# EAGLE board v1.9 (EAGLE 9.6.2)
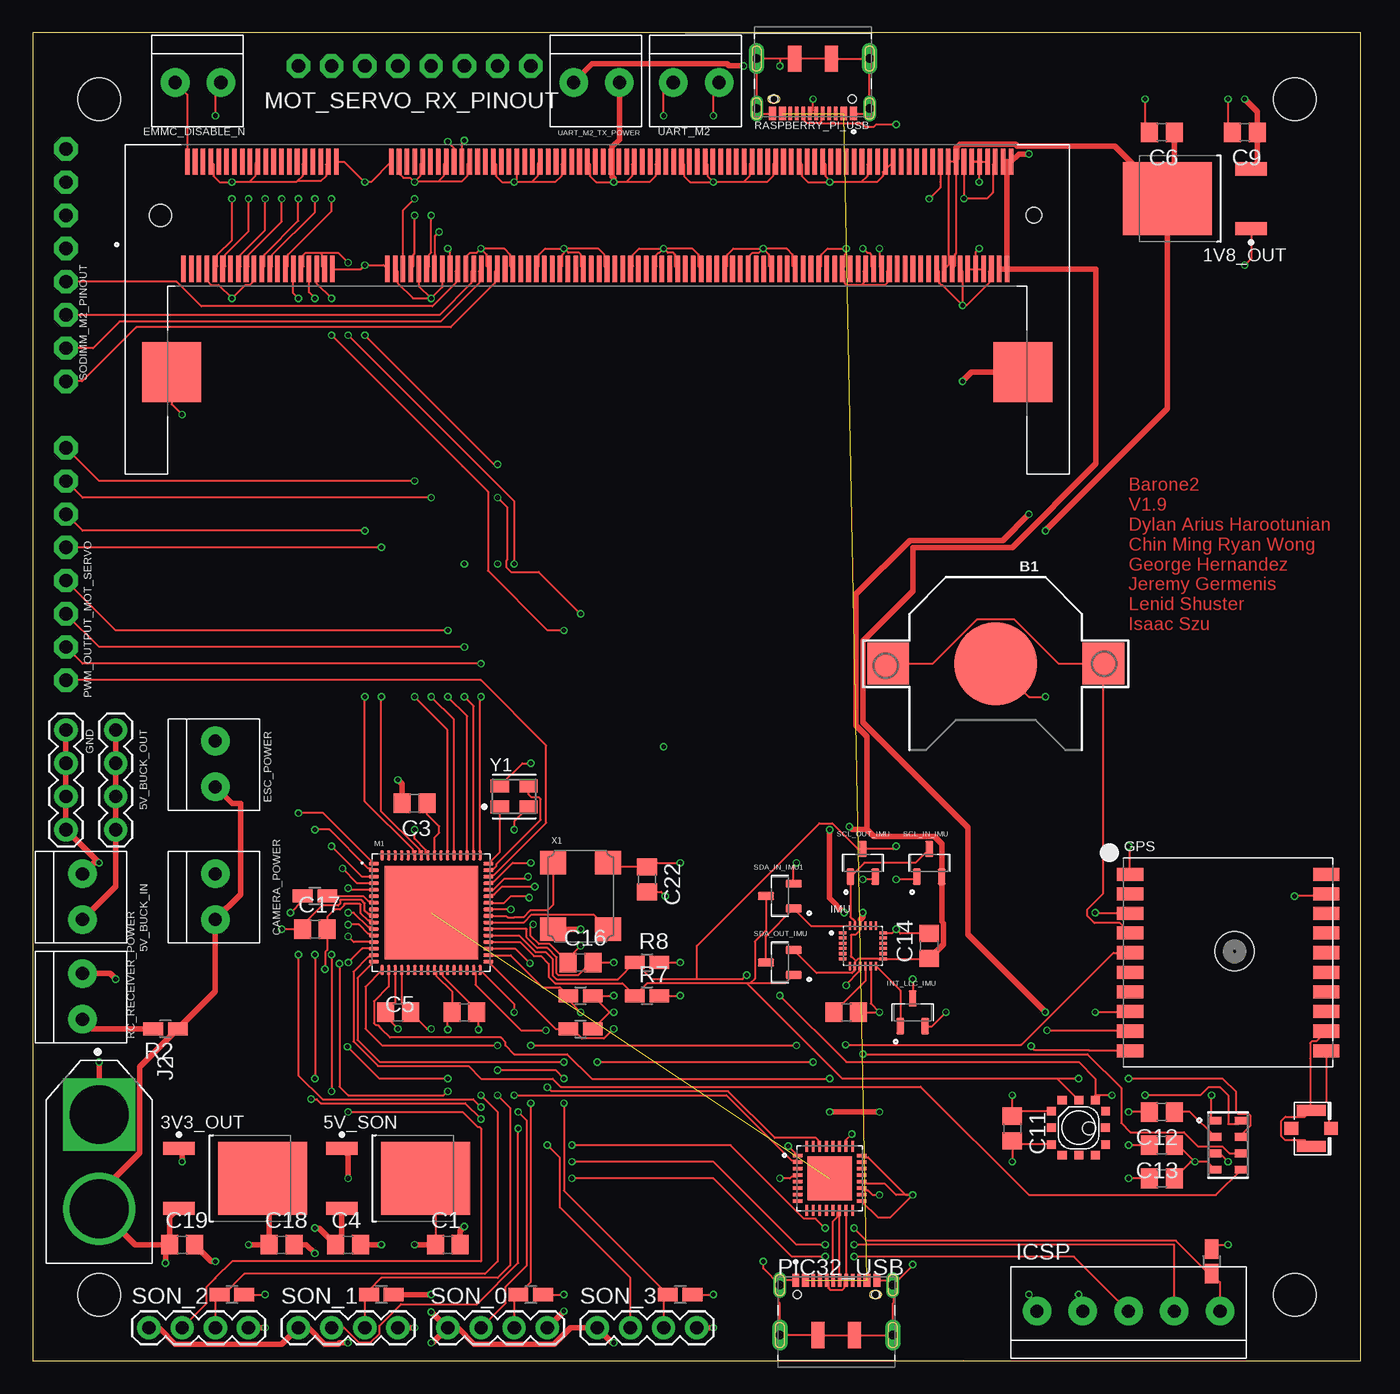
[diagram p2: board, top side]
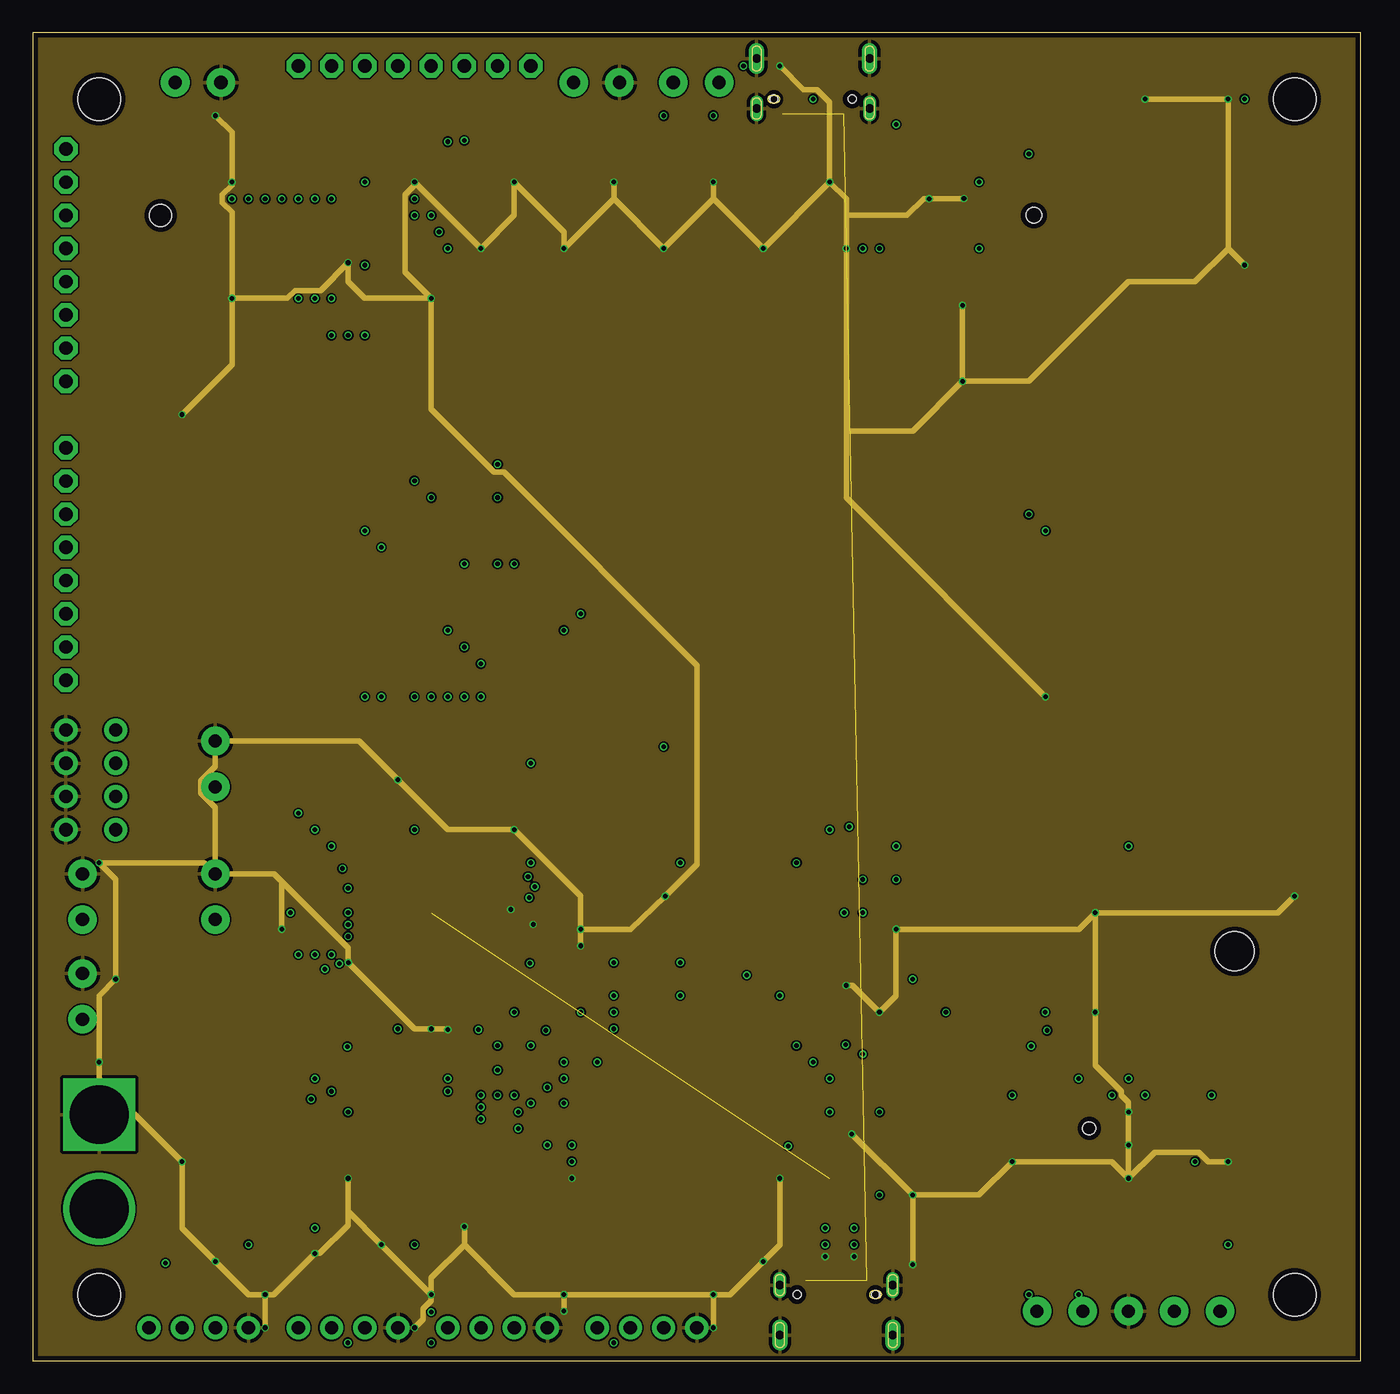
[diagram p3: board, inner layer Route2]
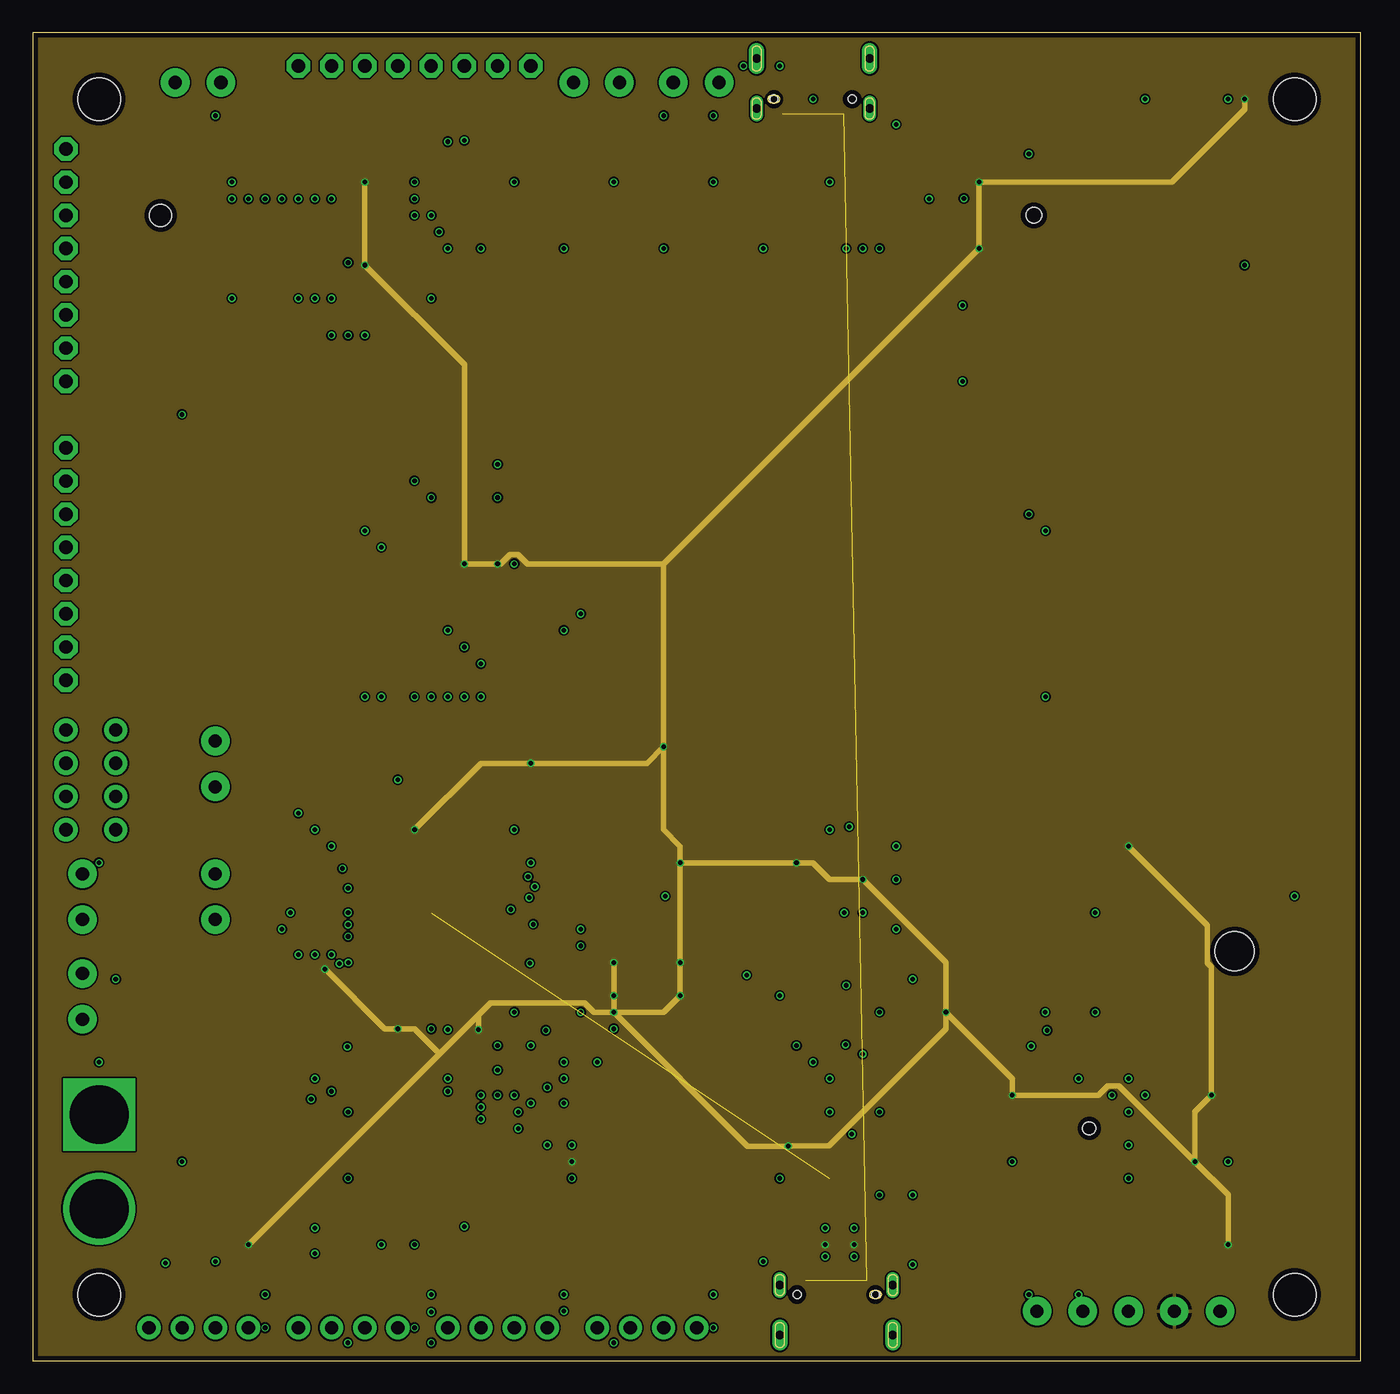
[diagram p4: board, inner layer Route15]
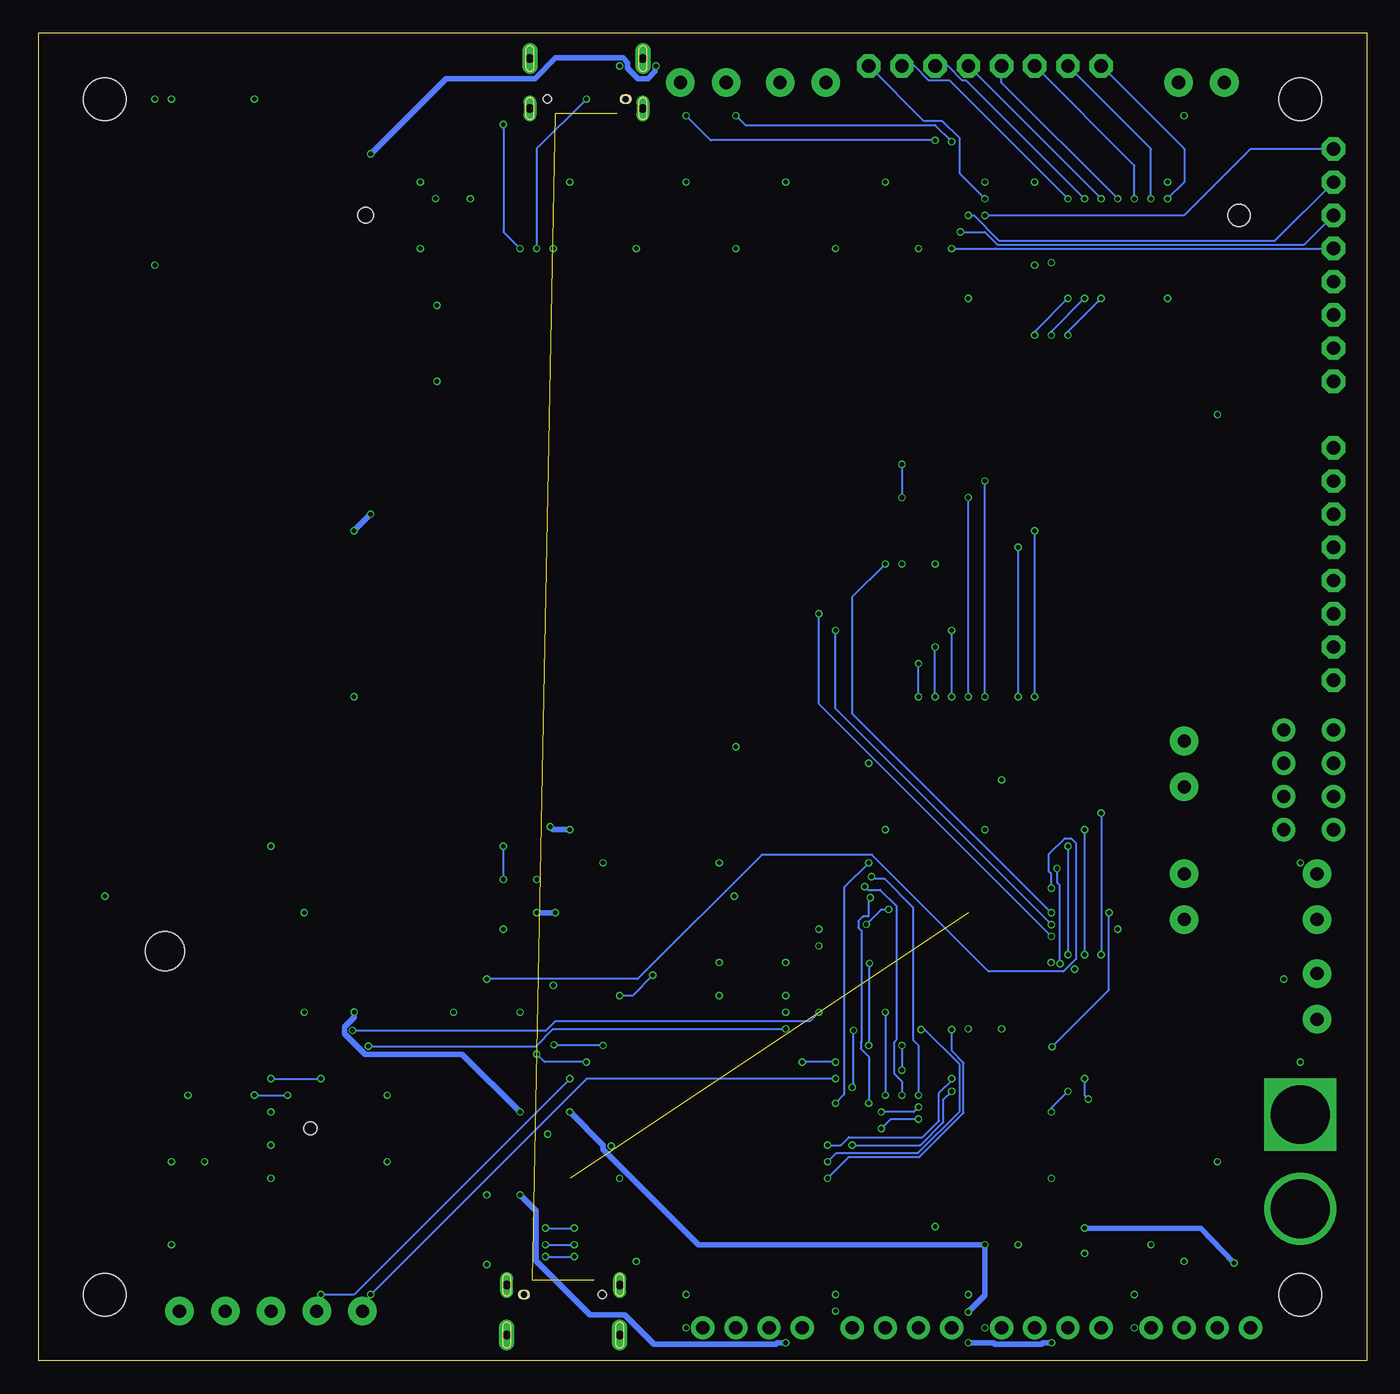
[diagram p5: board, bottom side, seen from below]

Size 101.6 x 101.6 mm. Coordinates in mm from the lower left corner, seen from the top.
Outline: 0,0 101.6,0 101.6,101.6 0,101.6 0,0
Copper layers (1*2*15*16): Top 0.035559375mm / dielectric 0.17018125mm / Route2 0.01778125mm / dielectric 47mil / Route15 0.01778125mm / dielectric 0.17018125mm / Bottom 0.035559375mm
Design rules "oshpark-4layer": minimum track width 5mil, minimum drill 10mil, track to track 5mil, track to pad 5mil, pad to pad 5mil, via to via 5mil, smd to smd 5mil, copper to edge 15mil, drill to drill 6mil, minimum pad ring 4mil, minimum via ring 4mil, stop-mask expansion 1.5mil, vias tented up to drill 0mil, thermal gap 10mil
Holes 3.26 mm at 96.52,5.08 96.52,96.52 5.08,96.52 5.08,5.08

## Footprints (pad centres in the part's own frame; a part is rotated, then mirrored left to right if it is on the bottom)
STMICROELECTRONICS_LD1117DT33CTR_2 = smd 2.4 x 1: 1 -4.3,2.28; 3 -4.3,-2.28 | smd 6.8 x 5.55: 4 2.1,0
1X2-3.5MM = drill 1 pad 2.184: 1 1.8,0; 2 -1.7,0
1X04-BIG = drill 1.016 pad 1.778: 1 0,0; 2 2.54,0; 3 5.08,0; 4 7.62,0
CR1220 = smd 3.2 x 3.2: +$1 -8.225,0; +$2 8.225,0 | smd 6.35 x 6.35: - 0,0
C0805 = smd 1.3 x 1.5: 1 -0.95,0; 2 0.95,0
FGPMMOPA6H = smd 2 x 1: P$1 -7.5,6.75; P$2 -7.5,5.25; P$3 -7.5,3.75; P$4 -7.5,2.25; P$5 -7.5,0.75; P$6 -7.5,-0.75; P$7 -7.5,-2.25; P$8 -7.5,-3.75; P$9 -7.5,-5.25; P$10 -7.5,-6.75; P$11 7.5,-6.75; P$12 7.5,-5.25; P$13 7.5,-3.75; P$14 7.5,-2.25; P$15 7.5,-0.75; P$16 7.5,0.75; P$17 7.5,2.25; P$18 7.5,3.75; P$19 7.5,5.25; P$20 7.5,6.75 | hole 3: 0.5,0.85
1X05-3.5MM = drill 1 pad 2.184: 1 7,0; 2 3.5,0; 3 0,0; 4 -3.5,0; 5 -7,0
QFN40P300X300X105-24N = smd 0.64 x 0.22: 1 -1.545,1; 2 -1.545,0.6; 3 -1.545,0.2; 4 -1.545,-0.2; 5 -1.545,-0.6; 6 -1.545,-1; 13 1.545,-1; 14 1.545,-0.6; 15 1.545,-0.2; 16 1.545,0.2; 17 1.545,0.6; 18 1.545,1 | smd 0.22 x 0.64: 7 -1,-1.545; 8 -0.6,-1.545; 9 -0.2,-1.545; 10 0.2,-1.545; 11 0.6,-1.545; 12 1,-1.545; 19 1,1.545; 20 0.6,1.545; 21 0.2,1.545; 22 -0.2,1.545; 23 -0.6,1.545; 24 -1,1.545
SOT95P240X111-3N = smd 1.23 x 0.6: 1 -1.06,0.95; 2 -1.06,-0.95; 3 1.06,0
AMASS_XT60-M = drill 4.5 square: 1 -3.6,0 | drill 4.5: 2 3.6,0
1X08-CLEANBIG = drill 1.016 pad 1.778 octagon: 1 -8.89,0; 2 -6.35,0; 3 -3.81,0; 4 -1.27,0; 5 1.27,0; 6 3.81,0; 7 6.35,0; 8 8.89,0
QFN50P900X900X100-65N = smd 0.76 x 0.26: 1 -4.385,3.75; 2 -4.385,3.25; 3 -4.385,2.75; 4 -4.385,2.25; 5 -4.385,1.75; 6 -4.385,1.25; 7 -4.385,0.75; 8 -4.385,0.25; 9 -4.385,-0.25; 10 -4.385,-0.75; 11 -4.385,-1.25; 12 -4.385,-1.75; 13 -4.385,-2.25; 14 -4.385,-2.75; 15 -4.385,-3.25; 16 -4.385,-3.75; 33 4.385,-3.75; 34 4.385,-3.25; 35 4.385,-2.75; 36 4.385,-2.25; 37 4.385,-1.75; 38 4.385,-1.25; 39 4.385,-0.75; 40 4.385,-0.25; 41 4.385,0.25; 42 4.385,0.75; 43 4.385,1.25; 44 4.385,1.75; 45 4.385,2.25; 46 4.385,2.75; 47 4.385,3.25; 48 4.385,3.75 | smd 0.26 x 0.76: 17 -3.75,-4.385; 18 -3.25,-4.385; 19 -2.75,-4.385; 20 -2.25,-4.385; 21 -1.75,-4.385; 22 -1.25,-4.385; 23 -0.75,-4.385; 24 -0.25,-4.385; 25 0.25,-4.385; 26 0.75,-4.385; 27 1.25,-4.385; 28 1.75,-4.385; 29 2.25,-4.385; 30 2.75,-4.385; 31 3.25,-4.385; 32 3.75,-4.385; 49 3.75,4.385; 50 3.25,4.385; 51 2.75,4.385; 52 2.25,4.385; 53 1.75,4.385; 54 1.25,4.385; 55 0.75,4.385; 56 0.25,4.385; 57 -0.25,4.385; 58 -0.75,4.385; 59 -1.25,4.385; 60 -1.75,4.385; 61 -2.25,4.385; 62 -2.75,4.385; 63 -3.25,4.385; 64 -3.75,4.385 | smd 7.15 x 7.15: 65 0,0
PSON125P300X500X120-8N = smd 0.95 x 0.6: 1 -1,1.875; 2 -1,0.625; 3 -1,-0.625; 4 -1,-1.875; 5 1,-1.875; 6 1,-0.625; 7 1,0.625; 8 1,1.875
MPR_SERIES_I2C_PRESSURE = smd 0.7 x 0.65: 1 -1.27,2.159; 2 0,2.159; 3 1.27,2.159; 5 2.05,0.059; 7 1.27,-2.041; 8 0,-2.041; 9 -1.27,-2.041; 10 -2.1,-1.211; 11 -2.1,0.059; 12 -2.1,1.329 | smd 0.65 x 0.65: 4 2.05,1.329; 6 2.05,-1.211 | hole 1: 0.81,0.009
JAE_DX07S016JA1R1500 = smd 0.52 x 1: 1 -3.1,1.1; 2 -2.35,1.1; 11 2.35,1.1; 12 3.1,1.1 | smd 0.27 x 1: 3 -1.75,1.1; 4 -1.25,1.1; 5 -0.75,1.1; 6 -0.25,1.1; 7 0.25,1.1; 8 0.75,1.1; 9 1.25,1.1; 10 1.75,1.1 | smd 1 x 2: S1 -1.4,-3.1; S2 1.4,-3.1 | drill 0.65 long: S3 -4.32,0.725; S4 4.32,0.725 | drill 0.65 pad 1.2 long: S5 -4.32,-3.1; S6 4.32,-3.1 | hole 0.6: 3,0 | hole 0.63: 3,0; -3,0
R0805W = smd 1.5 x 1: 1 -0.94,0; 2 0.94,0
AMPHENOL_10033854-052FSLF = smd 0.35 x 2: 1 -31.65,-4.1; 2 -31.35,4.1; 3 -31.05,-4.1; 4 -30.75,4.1; 5 -30.45,-4.1; 6 -30.15,4.1; 7 -29.85,-4.1; 8 -29.55,4.1; 9 -29.25,-4.1; 10 -28.95,4.1; 11 -28.65,-4.1; 12 -28.35,4.1; 13 -28.05,-4.1; 14 -27.75,4.1; 15 -27.45,-4.1; 16 -27.15,4.1; 17 -26.85,-4.1; 18 -26.55,4.1; 19 -26.25,-4.1; 20 -25.95,4.1; 21 -25.65,-4.1; 22 -25.35,4.1; 23 -25.05,-4.1; 24 -24.75,4.1; 25 -24.45,-4.1; 26 -24.15,4.1; 27 -23.85,-4.1; 28 -23.55,4.1; 29 -23.25,-4.1; 30 -22.95,4.1; 31 -22.65,-4.1; 32 -22.35,4.1; 33 -22.05,-4.1; 34 -21.75,4.1; 35 -21.45,-4.1; 36 -21.15,4.1; 37 -20.85,-4.1; 38 -20.55,4.1; 39 -20.25,-4.1; 40 -19.95,4.1; 41 -16.05,-4.1; 42 -15.75,4.1; 43 -15.45,-4.1; 44 -15.15,4.1; 45 -14.85,-4.1; 46 -14.55,4.1; 47 -14.25,-4.1; 48 -13.95,4.1; 49 -13.65,-4.1; 50 -13.35,4.1; 51 -13.05,-4.1; 52 -12.75,4.1; 53 -12.45,-4.1; 54 -12.15,4.1; 55 -11.85,-4.1; 56 -11.55,4.1; 57 -11.25,-4.1; 58 -10.95,4.1; 59 -10.65,-4.1; 60 -10.35,4.1; 61 -10.05,-4.1; 62 -9.75,4.1; 63 -9.45,-4.1; 64 -9.15,4.1; 65 -8.85,-4.1; 66 -8.55,4.1; 67 -8.25,-4.1; 68 -7.95,4.1; 69 -7.65,-4.1; 70 -7.35,4.1; 71 -7.05,-4.1; 72 -6.75,4.1; 73 -6.45,-4.1; 74 -6.15,4.1; 75 -5.85,-4.1; 76 -5.55,4.1; 77 -5.25,-4.1; 78 -4.95,4.1; 79 -4.65,-4.1; 80 -4.35,4.1; 81 -4.05,-4.1; 82 -3.75,4.1; 83 -3.45,-4.1; 84 -3.15,4.1; 85 -2.85,-4.1; 86 -2.55,4.1; 87 -2.25,-4.1; 88 -1.95,4.1; 89 -1.65,-4.1; 90 -1.35,4.1; 91 -1.05,-4.1; 92 -0.75,4.1; 93 -0.45,-4.1; 94 -0.15,4.1; 95 0.15,-4.1; 96 0.45,4.1; 97 0.75,-4.1; 98 1.05,4.1; 99 1.35,-4.1; 100 1.65,4.1; 101 1.95,-4.1; 102 2.25,4.1; 103 2.55,-4.1; 104 2.85,4.1; 105 3.15,-4.1; 106 3.45,4.1; 107 3.75,-4.1; 108 4.05,4.1; 109 4.35,-4.1; 110 4.65,4.1; 111 4.95,-4.1; 112 5.25,4.1; 113 5.55,-4.1; 114 5.85,4.1; 115 6.15,-4.1; 116 6.45,4.1; 117 6.75,-4.1; 118 7.05,4.1; 119 7.35,-4.1; 120 7.65,4.1; 121 7.95,-4.1; 122 8.25,4.1; 123 8.55,-4.1; 124 8.85,4.1; 125 9.15,-4.1; 126 9.45,4.1; 127 9.75,-4.1; 128 10.05,4.1; 129 10.35,-4.1; 130 10.65,4.1; 131 10.95,-4.1; 132 11.25,4.1; 133 11.55,-4.1; 134 11.85,4.1; 135 12.15,-4.1; 136 12.45,4.1; 137 12.75,-4.1; 138 13.05,4.1; 139 13.35,-4.1; 140 13.65,4.1; 141 13.95,-4.1; 142 14.25,4.1; 143 14.55,-4.1; 144 14.85,4.1; 145 15.15,-4.1; 146 15.45,4.1; 147 15.75,-4.1; 148 16.05,4.1; 149 16.35,-4.1; 150 16.65,4.1; 151 16.95,-4.1; 152 17.25,4.1; 153 17.55,-4.1; 154 17.85,4.1; 155 18.15,-4.1; 156 18.45,4.1; 157 18.75,-4.1; 158 19.05,4.1; 159 19.35,-4.1; 160 19.65,4.1; 161 19.95,-4.1; 162 20.25,4.1; 163 20.55,-4.1; 164 20.85,4.1; 165 21.15,-4.1; 166 21.45,4.1; 167 21.75,-4.1; 168 22.05,4.1; 169 22.35,-4.1; 170 22.65,4.1; 171 22.95,-4.1; 172 23.25,4.1; 173 23.55,-4.1; 174 23.85,4.1; 175 24.15,-4.1; 176 24.45,4.1; 177 24.75,-4.1; 178 25.05,4.1; 179 25.35,-4.1; 180 25.65,4.1; 181 25.95,-4.1; 182 26.25,4.1; 183 26.55,-4.1; 184 26.85,4.1; 185 27.15,-4.1; 186 27.45,4.1; 187 27.75,-4.1; 188 28.05,4.1; 189 28.35,-4.1; 190 28.65,4.1; 191 28.95,-4.1; 192 29.25,4.1; 193 29.55,-4.1; 194 29.85,4.1; 195 30.15,-4.1; 196 30.45,4.1; 197 30.75,-4.1; 198 31.05,4.1; 199 31.35,-4.1; 200 31.65,4.1 | smd 4.5 x 4.6: S1 -32.55,-12; S2 32.55,-12 | hole 1.7: -33.4,0 | hole 1.2: 33.4,0
QFN50P500X500X90-33N = smd 0.81 x 0.27: 1 -2.45,1.75; 2 -2.45,1.25; 3 -2.45,0.75; 4 -2.45,0.25; 5 -2.45,-0.25; 6 -2.45,-0.75; 7 -2.45,-1.25; 8 -2.45,-1.75; 17 2.45,-1.75; 18 2.45,-1.25; 19 2.45,-0.75; 20 2.45,-0.25; 21 2.45,0.25; 22 2.45,0.75; 23 2.45,1.25; 24 2.45,1.75 | smd 0.27 x 0.81: 9 -1.75,-2.45; 10 -1.25,-2.45; 11 -0.75,-2.45; 12 -0.25,-2.45; 13 0.25,-2.45; 14 0.75,-2.45; 15 1.25,-2.45; 16 1.75,-2.45; 25 1.75,2.45; 26 1.25,2.45; 27 0.75,2.45; 28 0.25,2.45; 29 -0.25,2.45; 30 -0.75,2.45; 31 -1.25,2.45; 32 -1.75,2.45 | smd 3.4 x 3.4: 33 0,0
U.FL = smd 2.2 x 0.85: P$1 0,1.375; P$2 0,-1.375 | smd 1.05 x 1: P$3 1.525,0; P$4 -1.525,0
OSCCC700X500X180-4N = smd 1.8 x 2: 1 -2.54,-2.1; 2 2.54,-2.1; 3 2.54,2.1; 4 -2.54,2.1
ABRACON_ASEK-32_768KHZ-LRT_0 = smd 1.4 x 1: 1 -1.1,-0.8; 2 1.1,-0.8; 3 1.1,0.8; 4 -1.1,0.8

## Placement (x,y rotation side)
1V8_OUT  STMICROELECTRONICS_LD1117DT33CTRSTMICROELECTRONICS_LD1117DT33CTR_0_2  [STMICROELECTRONICS_LD1117DT33CTR_2]  88.9,88.9 180 top
3V3_OUT  STMICROELECTRONICS_LD1117DT33CTRSTMICROELECTRONICS_LD1117DT33CTR_0_2  [STMICROELECTRONICS_LD1117DT33CTR_2]  15.49,13.97 0 top
5V_BUCK_IN  1X2-3.5MM  [1X2-3.5MM]  3.81,35.56 270 top
5V_BUCK_OUT  1X4-BIG  [1X04-BIG]  6.35,48.26 270 top
5V_SON  STMICROELECTRONICS_LD1117DT33CTRSTMICROELECTRONICS_LD1117DT50CTR_0_2  [STMICROELECTRONICS_LD1117DT33CTR_2]  27.94,13.97 0 top
B1  CR1220  [CR1220]  73.66,53.34 180 top
C1  10uF  [C0805]  31.75,8.89 0 top
C2  0.1uF  [C0805]  62.23,26.67 0 top
C3  10uF  [C0805]  29.21,42.67 180 top
C4  0.1uF  [C0805]  24.13,8.89 0 top
C5  0.1uF  [C0805]  27.94,26.67 180 top
C6  10uF  [C0805]  86.36,93.98 180 top
C7  10uF  [C0805]  86.36,13.97 180 top
C9  0.1uF  [C0805]  92.71,93.98 180 top
C11  0.1uF  [C0805]  74.93,17.78 270 top
C12  0.1uF  [C0805]  86.36,19.05 180 top
C13  0.1uF  [C0805]  86.36,16.51 180 top
C14  0.1uF  [C0805]  68.58,31.75 90 top
C15  0.1uF  [C0805]  33.02,26.67 0 top
C16  0.1uF  [C0805]  41.91,30.48 0 top
C17  0.1uF  [C0805]  21.59,33.02 0 top
C18  10uF  [C0805]  19.05,8.89 0 top
C19  0.1uF  [C0805]  11.43,8.89 0 top
C22  0.01uF  [C0805]  46.99,36.83 270 top
CAMERA_POWER  1X2-3.5MM  [1X2-3.5MM]  13.97,35.56 270 top
EMMC_DISABLE_N  1X2-3.5MM  [1X2-3.5MM]  12.7,97.79 180 top
ESC_POWER  1X2-3.5MM  [1X2-3.5MM]  13.97,45.72 270 top
GND  1X4-BIG  [1X04-BIG]  2.54,48.26 270 top
GPS  [FGPMMOPA6H]  91.44,30.48 0 top
ICSP  1X5  [1X05-3.5MM]  83.82,3.81 0 top
IMU  ICM-20948  [QFN40P300X300X105-24N]  63.5,31.75 0 top
INT_LLC_IMU  BSS138  [SOT95P240X111-3N]  67.31,26.67 90 top
J2  XT60-M  [AMASS_XT60-M]  5.08,15.24 270 top
JP1  [1X08-CLEANBIG]  2.54,83.82 90 top
M1  PIC32MX340F512H-80I/MR  [QFN50P900X900X100-65N]  30.48,34.29 0 top
MOT_SERVO_RX_PINOUT  [1X08-CLEANBIG]  29.21,99.06 0 top
MPL3115  MPL3115A2  [PSON125P300X500X120-8N]  91.44,16.51 0 top
MPR  MPR_SERIES_I2C_PRESSURE  [MPR_SERIES_I2C_PRESSURE]  80.01,17.78 0 top
PIC32_USB  DX07S016JA1R1500  [JAE_DX07S016JA1R1500]  61.47,5.08 0 top
PWM_OUTPUT_MOT_SERVO  [1X08-CLEANBIG]  2.54,60.96 90 top
R1  470  [R0805W]  21.59,35.56 180 top
R2  680  [R0805W]  10.16,25.4 180 top
R3  10k  [R0805W]  38.1,5.08 180 top
R4  10k  [R0805W]  26.67,5.08 180 top
R5  10k  [R0805W]  15.24,5.08 180 top
R6  10k  [R0805W]  49.53,5.08 180 top
R7  10k  [R0805W]  46.99,27.94 0 top
R8  10k  [R0805W]  46.99,30.48 0 top
R9  10k  [R0805W]  41.91,27.94 0 top
R10  10k  [R0805W]  41.91,25.4 0 top
R11  10k  [R0805W]  90.17,7.62 270 top
RASPBERRY_PI_USB  DX07S016JA1R1500  [JAE_DX07S016JA1R1500]  59.69,96.52 180 top
RC_RECEIVER_POWER  1X2-3.5MM  [1X2-3.5MM]  3.81,27.94 270 top
SCL_IN_IMU  BSS138  [SOT95P240X111-3N]  68.58,38.1 90 top
SCL_OUT_IMU  BSS138  [SOT95P240X111-3N]  63.5,38.1 90 top
SDA_IN_IMU1  BSS138  [SOT95P240X111-3N]  57.15,35.56 180 top
SDA_OUT_IMU  BSS138  [SOT95P240X111-3N]  57.15,30.48 180 top
SODIMM_M2_PINOUT  10033854-052FSLF  [AMPHENOL_10033854-052FSLF]  43.18,87.63 0 top
SON_0  [1X04-BIG]  31.75,2.54 0 top
SON_1  [1X04-BIG]  20.32,2.54 0 top
SON_2  [1X04-BIG]  8.89,2.54 0 top
SON_3  [1X04-BIG]  43.18,2.54 0 top
U1  FT232RQ  [QFN50P500X500X90-33N]  60.96,13.97 0 top
U.FL  U.FL  [U.FL]  97.79,17.78 0 top
UART_M2  1X2-3.5MM  [1X2-3.5MM]  50.8,97.79 180 top
UART_M2_TX_POWER  1X2-3.5MM  [1X2-3.5MM]  43.18,97.79 180 top
X1  CB3LV-3C-8M0000  [OSCCC700X500X180-4N]  41.91,35.56 270 top
Y1  ABRACON_ASEK-32_768KHZ-LRTABRACON_ASEK-32_768KHZ-LRT_0_0  [ABRACON_ASEK-32_768KHZ-LRT_0]  36.83,43.18 0 top

## Tracks (layer width: path | path; a pad name or v marks a point on that pad's centre or on a via)
1.8V  (via drill 0.35)
  Top 0.152: C6.1 87.63,93.66 | 70.92,92.91 70.83,92.83 70.83,91.93 SODIMM_M2_PINOUT.186 | 1V8_OUT.4 86.58,89.12 82.77,92.93 82.74,92.96 | SODIMM_M2_PINOUT.186 SODIMM_M2_PINOUT.184 70.03,83.83 SODIMM_M2_PINOUT.183 | SODIMM_M2_PINOUT.186 70.63,84.73 70.53,84.62 70.53,83.73 SODIMM_M2_PINOUT.185 | 62.96,30.6 63.11,30.75 64.69,30.75 IMU.13 68.45,30.75 68.49,30.71 | IMU.22 63.24,33.23 63.24,32.9 62.94,32.6 62.62,32.6 62.57,32.55 62.57,30.95 62.62,30.9 62.66,30.9 62.96,30.6 | 62.96,30.6 62.9,30.54 IMU.8 62.81,30.12 62.81,29.82 62.68,29.68 59.96,29.68 SDA_OUT_IMU.2
  Top 0.406: C6.1 87.31,89.85 86.58,89.12 | SODIMM_M2_PINOUT.186 70.63,92.81 70.91,93.09 75.15,93.09 75.31,92.93 82.77,92.93 1V8_OUT.4 86.8,72.83 v77.47,63.5 | v76.2,64.77 74.19,62.76 67.09,62.76 62.97,58.65 62.97,48.61 63.82,47.76 63.82,40.64 | 68.49,30.71 C14.1 69.66,31.88 69.66,33.49 69.53,33.62 SCL_IN_IMU.2 69.53,39.55 68.97,40.1 64.36,40.1 63.82,40.64 | 63.82,40.64 62.7,40.64 v62.46,40.87 | v60.96,40.64 60.96,35.4 v62.07,34.29 | v63.5,34.29 63.5,33.98 63.3,33.78
  Bottom 0.406: v77.47,63.5 v76.2,64.77 | v62.46,40.87 62.23,40.64 v60.96,40.64 | v62.07,34.29 v63.5,34.29
5V  (via drill 0.35)
  Top 0.152: U1.19 63.57,13.06 63.88,13.06 64.24,12.7 v64.77,12.7 | 5V_SON.4 30.8,13.21 C1.1
  Top 0.406: SODIMM_M2_PINOUT.199 81.34,83.53 81.34,68.64 74.93,62.23 67.31,62.23 67.31,58.88 63.5,55.08 63.5,48.83 71.53,40.81 71.53,32.61 v77.45,26.69 | SODIMM_M2_PINOUT.199 SODIMM_M2_PINOUT.197 | SODIMM_M2_PINOUT.199 74.53,91.43 SODIMM_M2_PINOUT.200 | SODIMM_M2_PINOUT.200 SODIMM_M2_PINOUT.198 | SON_0.1 32.53,2.54 33.77,1.29 39.89,1.29 41.13,2.54 SON_3.1 44.33,1.39 v44.45,1.39 | v24.11,1.39 23.47,1.39 23.38,1.29 22.34,1.29 21.1,2.54 SON_1.1 19.05,1.27 17.78,1.27 17.75,1.29 10.91,1.29 9.67,2.54 SON_2.1 | v30.48,1.39 30.6,1.39 SON_0.1 | SON_0.1 31.68,2.54 v30.48,3.75 | v29.21,8.89 C1.1 30.48,9.21 | v54.37,99.06 53.24,99.06 53.09,99.21 42.8,99.21 UART_M2_TX_POWER.1 | v76.2,92.32 75.42,92.32 SODIMM_M2_PINOUT.200 | v64.77,19.05 v60.96,19.05
  Bottom 0.406: v24.11,1.39 24.79,1.39 24.88,1.29 28.46,1.29 28.55,1.39 v30.48,1.39 | v30.48,3.75 29.21,5.01 v29.21,8.89 51.11,8.89 58.41,16.18 58.41,16.5 v60.96,19.05 | v44.45,1.39 45.11,1.39 45.2,1.29 54.51,1.29 56.76,3.55 59.43,3.55 63.56,7.68 63.56,11.49 v64.77,12.7 | v54.37,99.06 54.44,98.99 54.44,98.64 54.98,98.09 55.76,98.09 56.54,98.88 56.54,99.31 56.9,99.67 62.05,99.67 63.62,98.09 70.43,98.09 v76.2,92.32 | v64.77,19.05 69.19,23.47 76.62,23.47 78.19,25.04 78.19,25.54 77.45,26.28 v77.45,26.69
9.6V-12.6V  (via drill 0.35)
  Top 0.406: v21.59,10.16 21.91,10.16 C4.1 23.64,9.35 5V_SON.3 | v10.16,7.49 10.16,8.57 C19.1 | C19.1 7.83,8.89 5.18,11.54 | 5.18,11.54 J2.2 | 5.18,11.54 5.18,12.93 8.19,15.94 8.19,22.49 R2.1 13.97,28.27 CAMERA_POWER.1 15.9,35.69 15.9,42.65 15.24,42.65 ESC_POWER.1 | C19.1 10.48,10.98 3V3_OUT.3
  Bottom 0.406: v21.59,10.16 12.7,10.16 v10.16,7.49
ECHO_SON0  (via drill 0.35)
  Top 0.152: M1.42 36.06,35.04 36.58,35.56 37.85,35.56 v37.98,35.44 | 36.83,5.08 R3.2 | R3.2 36.83,4.75 SON_0.3 | v38.1,19.71 38.1,6.02 R3.2
  Bottom 0.152: v38.1,19.71 38.1,23.27 38.71,23.88 38.71,24.38 38.65,24.44 38.65,32.91 38.89,33.14 38.89,33.65 38.53,34 38.14,34 38.14,35.27 v37.98,35.44
ECHO_SON1  (via drill 0.35)
  Top 0.152: M1.43 35.01,35.68 35.3,35.68 35.91,36.29 v38.41,36.29 | SON_1.3 25.4,4.75 R4.2 25.73,5.41 26.67,6.35 35.56,6.35 36.52,7.32 36.52,19.36 v35.56,20.32
  Bottom 0.152: v38.41,36.29 38.16,36.04 37.22,36.04 35.97,34.79 35.97,24.57 36.17,24.38 36.17,22 35.56,21.39 v35.56,20.32
ECHO_SON2  (via drill 0.35)
  Top 0.152: M1.44 35.23,36.04 36.08,36.89 37.74,36.89 v37.89,37.04 | SON_2.3 13.97,4.75 R5.2 14.61,5.08 16.18,6.66 34.59,6.66 35.56,7.62 35.56,19.05 v34.29,20.32
  Bottom 0.152: v37.89,37.04 37.74,36.89 36.89,36.89 34.7,34.71 34.7,24.54 34.29,24.13 v34.29,20.32
ECHO_SON3  (via drill 0.35)
  Top 0.152: M1.45 35.01,36.68 35.3,36.68 36.72,38.1 v38.1,38.1 | SON_3.3 48.26,4.75 R6.2 40.64,13.03 v40.64,19.71
  Bottom 0.152: v40.64,19.71 39.98,20.38 39.98,36.22 v38.1,38.1
EXP  (1 unrouted)
GND  (via drill 0.35)
  Top 0.152: 1V8_OUT.1 93.2,84.31 v92.71,83.82 | C9.2 91.44,94.3 v91.44,96.52 | C6.2 85.09,94.3 v85.09,96.52 | 57.15,99.62 RASPBERRY_PI_USB.S2 RASPBERRY_PI_USB.S1 RASPBERRY_PI_USB.S5 RASPBERRY_PI_USB.S3 63.63,95.42 RASPBERRY_PI_USB.1 | 57.15,99.62 RASPBERRY_PI_USB.S6 RASPBERRY_PI_USB.S4 55.74,95.42 RASPBERRY_PI_USB.12 | 57.15,99.62 v57.15,99.06 | SODIMM_M2_PINOUT.8 13.83,91.53 13.83,90.64 14.29,90.17 v15.24,90.17 16.57,90.17 | SODIMM_M2_PINOUT.20 17.03,91.53 17.03,90.64 16.57,90.17 | SODIMM_M2_PINOUT.32 20.63,91.53 20.63,90.64 20.24,90.25 | 20.24,90.25 20.17,90.17 16.57,90.17 | SODIMM_M2_PINOUT.38 22.43,91.53 22.43,90.64 22.04,90.25 20.24,90.25 | SODIMM_M2_PINOUT.44 28.03,90.83 28.36,90.5 28.88,90.5 v29.21,90.17 29.21,90.21 | SODIMM_M2_PINOUT.50 29.63,91.53 29.63,90.64 29.21,90.21 | SODIMM_M2_PINOUT.56 31.43,91.53 31.43,90.64 31.01,90.21 | 31.01,90.21 29.21,90.21 | SODIMM_M2_PINOUT.62 33.23,91.53 33.23,90.64 32.81,90.21 31.01,90.21 | SODIMM_M2_PINOUT.68 35.43,91.53 35.43,90.64 35.89,90.17 v36.83,90.17 | SODIMM_M2_PINOUT.74 37.03,90.37 v36.83,90.17 | SODIMM_M2_PINOUT.80 38.63,91.53 38.63,90.64 38.17,90.17 v36.83,90.17 | SODIMM_M2_PINOUT.86 40.43,91.53 40.43,90.64 39.97,90.17 v36.83,90.17 | SODIMM_M2_PINOUT.92 42.63,91.53 42.63,90.64 43.09,90.17 v44.45,90.17 | SODIMM_M2_PINOUT.98 44.43,91.53 44.43,90.64 44.45,90.61 v44.45,90.17 | SODIMM_M2_PINOUT.104 45.83,91.53 45.83,90.64 45.37,90.17 | 45.37,90.17 v44.45,90.17 | SODIMM_M2_PINOUT.110 47.63,91.53 47.63,90.64 47.17,90.17 45.37,90.17 | SODIMM_M2_PINOUT.116 49.83,91.53 49.83,90.64 50.29,90.17 v52.07,90.17 | SODIMM_M2_PINOUT.122 51.63,91.53 51.63,90.64 52.07,90.19 v52.07,90.17
  Top 0.152: SODIMM_M2_PINOUT.134 54.83,91.53 54.83,90.64 54.37,90.17 | 54.37,90.17 v52.07,90.17 | SODIMM_M2_PINOUT.140 56.63,91.53 56.63,90.64 56.17,90.17 54.37,90.17 | SODIMM_M2_PINOUT.146 58.83,91.53 58.83,90.64 59.29,90.17 v60.96,90.17 | SODIMM_M2_PINOUT.152 60.63,91.53 60.63,90.64 60.96,90.3 v60.96,90.17 | SODIMM_M2_PINOUT.164 63.83,91.53 63.83,90.64 63.37,90.17 | 63.37,90.17 v60.96,90.17 | SODIMM_M2_PINOUT.170 65.23,91.13 | 65.23,91.13 65.03,90.93 65.03,90.64 64.57,90.17 63.37,90.17 | SODIMM_M2_PINOUT.182 69.43,90.18 | 69.43,90.18 69.42,90.17 | v71.23,88.91 v71.24,88.9 | SODIMM_M2_PINOUT.196 73.43,91.53 73.43,89.36 72.97,88.91 v71.23,88.91 | SODIMM_M2_PINOUT.7 13.33,82.63 13.66,82.3 14.22,82.3 v15.24,81.28 16.26,82.3 16.6,82.3 16.93,82.63 SODIMM_M2_PINOUT.19 | SODIMM_M2_PINOUT.31 20.73,83.73 20.73,84.62 20.86,84.76 22,84.76 | SODIMM_M2_PINOUT.37 22.13,83.73 22.13,84.62 22,84.76 | SODIMM_M2_PINOUT.61 33.13,84.43 33.46,84.76 33.96,84.76 v34.29,85.09 34.29,85.07 | SODIMM_M2_PINOUT.67 34.73,83.73 34.73,84.62 34.29,85.07 | SODIMM_M2_PINOUT.73 36.53,83.73 36.53,84.62 36.09,85.07 34.29,85.07 | SODIMM_M2_PINOUT.43 27.93,83.33 27.93,82.44 29.08,81.28 v30.48,81.28 | SODIMM_M2_PINOUT.79 38.73,83.73 38.73,84.62 39.19,85.09 v40.64,85.09 | SODIMM_M2_PINOUT.85 40.53,83.73 40.53,84.62 40.64,84.74 v40.64,85.09 | SODIMM_M2_PINOUT.91 41.93,83.73 41.93,84.62 41.8,84.76 40.97,84.76 v40.64,85.09 | SODIMM_M2_PINOUT.97 43.73,83.73 43.73,84.62 43.27,85.09 v40.64,85.09 | SODIMM_M2_PINOUT.103 45.93,83.73 45.93,84.62 46.39,85.09 v48.26,85.09 | SODIMM_M2_PINOUT.109 47.73,83.73 47.73,84.62 47.86,84.76 47.93,84.76 v48.26,85.09
  Top 0.152: SODIMM_M2_PINOUT.115 49.13,83.73 49.13,84.62 49,84.76 48.59,84.76 v48.26,85.09 | SODIMM_M2_PINOUT.121 50.93,83.73 50.93,84.62 50.47,85.09 v48.26,85.09 | SODIMM_M2_PINOUT.127 53.13,83.73 53.13,84.62 53.59,85.09 v55.88,85.09 | v55.88,85.09 55.55,84.76 55.06,84.76 54.73,84.43 SODIMM_M2_PINOUT.133 | SODIMM_M2_PINOUT.139 56.33,83.73 56.33,84.62 55.88,85.08 | 55.88,85.08 v55.88,85.09 | SODIMM_M2_PINOUT.145 58.13,83.73 58.13,84.62 57.68,85.08 55.88,85.08 | SODIMM_M2_PINOUT.151 60.33,83.73 60.33,84.62 60.79,85.09 v62.23,85.09 62.23,84.73 62.13,84.62 62.13,83.73 SODIMM_M2_PINOUT.157 62.13,83.33 62.13,82.44 62.26,82.3 63.4,82.3 | 63.4,82.3 63.53,82.44 63.53,83.33 SODIMM_M2_PINOUT.163 | SODIMM_M2_PINOUT.169 65.33,83.33 65.33,82.44 65.2,82.3 63.4,82.3 | SODIMM_M2_PINOUT.181 69.33,83.33 69.33,82.55 | 69.33,82.55 69.33,82.44 | SODIMM_M2_PINOUT.195 73.13,83.33 73.13,82.44 71.44,80.75 v71.12,80.75 | SODIMM_M2_PINOUT.S1 10.63,73.19 v11.43,72.39 | 47.31,35.56 C22.2 48.07,35.88 v48.39,35.56 | 37.58,42.38 Y1.2 36.83,41.28 v36.83,40.64 | MPR.10 75.19,16.57 C11.2 v74.93,15.24 | R3.1 v40.64,5.08 | R6.1 v52.07,5.08 | R5.1 v17.78,5.08 | IMU.18 65.77,32.75 v66.04,33.02 66.36,32.7 C14.2 | C2.2 v64.77,26.67 64.1,27.34 IMU.11 | GPS.P$3 81.34,34.23 v81.28,34.29 | GPS.P$19 98.77,35.56 v96.52,35.56 | GPS.P$8 83.88,26.67 v81.28,26.67 | B1.- 76.2,50.8 v77.47,50.8 | C13.2 v83.82,16.51 | C7.2 v83.82,13.97 | U1.17 64.68,10.95 65.56,10.95 v67.31,12.7 | U1.20 63.55,13.58 65.16,13.58 66.04,12.7 v67.31,12.7 | U1.24 63.55,15.58 63.89,15.58 66.77,12.7 v67.31,12.7 | U1.4 58.37,14.08 58.03,14.08 57.92,13.97 v57.15,13.97
  Top 0.152: PIC32_USB.S4 65.79,5.75 65.88,5.66 65.88,4.5 65.79,4.41 PIC32_USB.S6 PIC32_USB.S2 PIC32_USB.S1 PIC32_USB.S5 57.15,4.41 57.06,4.5 57.06,5.66 57.15,5.75 PIC32_USB.S3 | PIC32_USB.S3 55.88,7.07 v55.88,7.62 | PIC32_USB.12 65.41,6.18 PIC32_USB.S4 | PIC32_USB.1 57.52,6.18 PIC32_USB.S3 | MPL3115.3 90.8,15.88 v91.44,15.24 | SODIMM_M2_PINOUT.168 65.23,91.13 | EMMC_DISABLE_N.2 13.97,97.36 v13.97,95.25 | 69.43,90.18 69.43,89.75 v68.58,88.9 | SODIMM_M2_PINOUT.188 v71.23,88.91 | 22,84.76 23.38,84.76 v24.13,84.01 | SODIMM_M2_PINOUT.49 29.53,82.23 v30.48,81.28 | SODIMM_M2_PINOUT.55 31.33,82.13 v30.48,81.28 | SODIMM_M2_PINOUT.187 71.12,83.34 v71.12,80.75 | 69.33,82.55 69.35,82.53 69.35,82.45 69.47,82.33 69.54,82.33 v71.12,80.75 | C12.2 v83.82,19.05 | U1.26 62.21,16.9 v62.66,17.35 | PIC32_USB.S4 67.31,7.33 v67.31,7.37 | IMU.9 63.21,30.12 63.21,29.79 62.23,28.8 v62.23,28.73 | M1.14 25.21,31.54 v24.15,30.48 | M1.20 28.23,27.33 C5.1 30.16,25.4 v30.48,25.4 | M1.25 30.87,29.76 30.87,29.47 32.07,28.27 C15.1 31.75,26.35 v31.75,25.35 | ICSP.3 79.65,7.98 v62.83,7.98 | v60.61,7.98 58.06,7.98 52.07,13.97 v41.25,13.97 | v36.58,34.54 M1.41 | v38.28,33.39 38.1,33.22 38.1,32.51 38.72,31.89 39.55,31.89 C16.1 40.96,30.8 v41.91,31.75 | M1.9 25.95,34.18 25.66,34.18 25.4,34.44 25.4,35.01 25.16,35.26 23.51,35.26 23.51,34.97 23.38,34.83 22.13,34.83 20.64,33.34 C17.1 v19.05,33.02
  Top 0.406: SODIMM_M2_PINOUT.S2 71.82,75.63 v71.12,74.93 | SON_2.4 v17.78,2.54 | SON_1.4 v29.21,2.54 | SON_3.4 v52.07,2.54 | 33.02,9.21 C1.2 32.7,9.97 v33.02,10.29 | C19.2 13.65,7.62 v13.97,7.62 | C4.2 v26.67,8.89 | 5V_SON.1 24.13,15.76 v24.13,13.97 | 3V3_OUT.1 11.43,16.01 v11.43,15.24 | J2.1 v5.08,22.86 | 5V_BUCK_IN.2 4.65,38.1 v5.08,38.1 GND.4 GND.3 GND.2 GND.1 | RC_RECEIVER_POWER.2 5.92,29.64 v6.35,29.21 | v27.94,44.45 28.26,44.13 C3.2 | v41.91,33.02 X1.2 | C18.2 20.93,8.89 v21.59,8.23 | SON_0.4 v40.64,3.81 | R4.1 v30.48,5.08 | UART_M2_TX_POWER.2 44.88,93.42 44.33,92.87 44.33,90.59 44.45,90.47 v44.45,90.17
  Route2 0.406: v85.09,96.52 v91.44,96.52 91.44,85.09 | 91.44,85.09 v92.71,83.82 | 91.44,85.09 88.9,82.55 83.82,82.55 76.2,74.93 v71.12,74.93 | v60.96,90.17 62.23,88.9 62.23,87.63 | 62.23,87.63 v62.23,85.09 62.23,71.12 | 62.23,87.63 66.88,87.63 68.15,88.9 v68.58,88.9 v68.59,88.91 v71.23,88.91 | 52.07,88.9 v55.88,85.09 v60.96,90.17 | 44.45,88.9 v48.26,85.09 52.07,88.9 | v44.45,90.17 44.45,88.9 | v52.07,90.17 52.07,88.9 | v15.24,81.28 15.24,87.86 14.51,88.6 14.51,89.2 15.24,89.94 v15.24,90.17 15.24,93.98 v13.97,95.25 | v15.24,81.28 15.24,76.2 v11.43,72.39 | 62.23,71.12 62.23,66.04 v77.47,50.8 | v57.15,99.06 58.96,97.25 59.99,97.25 60.96,96.29 v60.96,90.17 | v71.12,74.93 67.31,71.12 62.23,71.12 | v71.12,74.93 v71.12,80.75 | v96.52,35.56 95.25,34.29 v81.28,34.29 | v81.28,34.29 v81.28,26.67 81.28,22.63 83.28,20.62 83.28,20.32 | v83.82,13.97 v83.82,16.51 v83.82,19.05 83.82,19.78 83.28,20.32 | v91.44,15.24 89.94,15.24 89.2,15.97 85.82,15.97 v83.82,13.97 | v83.82,13.97 82.55,15.24 v74.93,15.24 72.39,12.7 v67.31,12.7 | v67.31,12.7 v67.31,7.37 | v52.07,5.08 53.34,5.08 v55.88,7.62 57.15,8.89 v57.15,13.97 | v52.07,5.08 v52.07,2.54 | v40.64,5.08 v52.07,5.08 | v17.78,5.08 18.44,5.08 v21.59,8.23 21.96,8.23 24.13,10.39 v24.13,13.97 24.13,11.43 v26.67,8.89 v30.48,5.08 | v17.78,5.08 16.51,5.08 v13.97,7.62 11.43,10.16 v11.43,15.24 5.08,21.59 v5.08,22.86 | J2.1 v5.08,22.86 | v5.08,22.86 5.08,27.94 v6.35,29.21 6.35,36.83 v5.08,38.1 13.13,38.1 CAMERA_POWER.2 | CAMERA_POWER.2 13.97,42.35 12.86,43.46 12.86,44.38 13.97,45.49 ESC_POWER.2 24.97,47.42 v27.94,44.45 31.75,40.64 v36.83,40.64 41.91,35.56 v41.91,33.02
  Route2 0.406: v17.78,2.54 v17.78,5.08 | v62.65,17.36 v62.66,17.35 v67.31,12.7 | v81.28,34.29 80.01,33.02 v66.04,33.02 66.04,27.94 v64.77,26.67 62.71,28.73 v62.23,28.73 | v41.91,33.02 45.72,33.02 v48.39,35.56 50.8,37.97 50.8,53.21 36.04,67.97 35.31,67.97 30.48,72.8 v30.48,81.28 | 83.28,20.31 83.28,20.32 | 44.45,88.9 v40.64,85.09 40.64,86.36 v36.83,90.17 36.83,87.63 v34.29,85.09 v29.21,90.17 29.21,89.94 28.48,89.2 28.48,83.28 v30.48,81.28 | v15.24,81.28 19.46,81.28 20.07,81.89 22.01,81.89 v24.13,84.01 24.13,82.55 25.4,81.28 v30.48,81.28 | 33.02,8.89 v33.02,10.29 | v40.64,5.08 v40.64,3.81 | v40.64,5.08 36.83,5.08 33.02,8.89 | v30.48,5.08 30.48,4.6 29.87,4 29.87,3.2 v29.21,2.54 | v30.48,5.08 30.48,6.35 33.02,8.89 | CAMERA_POWER.2 18.48,37.26 18.98,36.76 19.05,36.69 | 19.05,36.69 24.15,31.6 v24.15,30.48 29.23,25.4 v30.48,25.4 31.7,25.4 v31.75,25.35 | v41.91,31.75 v41.91,33.02 | v19.05,33.02 19.05,36.69
  Bottom 0.152: v62.83,7.98 v60.61,7.98 | v41.25,13.97 39.62,15.6 34.2,15.6 30.84,18.96 30.84,22.81 31.75,23.72 v31.75,25.35 | v38.28,33.39 37.13,34.54 v36.58,34.54
  pour Route2: -1.27,102.87 -1.27,-1.27 102.87,-1.27 102.87,102.87
GPIO2_M2  (via drill 0.35)
  Top 0.152: SODIMM_M2_PINOUT.9 14.13,83.73 14.13,84.62 15.24,85.74 v15.24,88.9
  Bottom 0.152: v15.24,88.9 13.97,90.17 13.97,92.71 MOT_SERVO_RX_PINOUT.1
GPIO3_M2  (via drill 0.35)
  Top 0.152: SODIMM_M2_PINOUT.11 14.73,83.73 14.73,84.62 16.51,86.41 v16.51,88.9
  Bottom 0.152: v16.51,88.9 16.51,92.71 MOT_SERVO_RX_PINOUT.2
GPIO4_M2  (via drill 0.35)
  Top 0.152: SODIMM_M2_PINOUT.15 15.93,83.73 15.93,84.62 17.78,86.48 v17.78,88.9
  Bottom 0.152: v17.78,88.9 17.78,91.44 MOT_SERVO_RX_PINOUT.3
GPIO5_M2  (via drill 0.35)
  Top 0.152: SODIMM_M2_PINOUT.17 16.53,83.73 16.53,84.62 19.05,87.15 v19.05,88.9
  Bottom 0.152: v19.05,88.9 27.94,97.79 MOT_SERVO_RX_PINOUT.4
GPIO6_M2  (via drill 0.35)
  Top 0.152: SODIMM_M2_PINOUT.21 17.73,83.73 17.73,84.62 20.32,87.22 v20.32,88.9
  Bottom 0.152: v20.32,88.9 MOT_SERVO_RX_PINOUT.5
GPIO7_M2  (via drill 0.35)
  Top 0.152: SODIMM_M2_PINOUT.23 18.33,83.73 18.33,84.62 21.59,87.89 v21.59,88.9
  Bottom 0.152: v21.59,88.9 30.63,97.94 30.94,97.94 32.06,99.06 MOT_SERVO_RX_PINOUT.6
GPIO8_M2  (via drill 0.35)
  Top 0.152: SODIMM_M2_PINOUT.27 19.53,83.73 19.53,84.62 22.86,87.96 v22.86,88.9
  Bottom 0.152: v22.86,88.9 31.75,97.79 31.9,97.94 33.48,97.94 34.6,99.06 MOT_SERVO_RX_PINOUT.7
GPIO12_M2  (via drill 0.35)
  Top 0.152: SODIMM_M2_PINOUT.45 28.33,88.02 v29.21,88.9
  Bottom 0.152: MOT_SERVO_RX_PINOUT.8 33.88,94.83 32.47,94.83 31.14,93.51 31.14,90.83 v29.21,88.9
GPIO13_M2  (via drill 0.35)
  Top 0.152: SODIMM_M2_PINOUT.47 29.13,83.73 29.13,84.62 29.21,84.71 v29.21,87.63
  Bottom 0.152: v29.21,87.63 13.97,87.63 8.89,92.71 JP1.8
GPIO14_M2  (via drill 0.35)
  Top 0.152: SODIMM_M2_PINOUT.51 30.33,83.73 30.33,84.62 30.48,84.78 v30.48,87.63
  Bottom 0.152: v30.48,87.63 30.07,87.63 28.13,85.69 7.02,85.69 JP1.7
GPIO15_M2  (via drill 0.35)
  Top 0.152: SODIMM_M2_PINOUT.53 30.73,84.6 30.79,84.65 30.79,86.06 v31.09,86.36
  Bottom 0.152: v31.09,86.36 29.23,86.36 28.25,85.38 4.79,85.38 JP1.6
GPIO16_M2  (via drill 0.35)
  Top 0.152: SODIMM_M2_PINOUT.57 31.93,84.91 v31.75,85.09
  Bottom 0.152: v31.75,85.09 28.39,85.09 28.38,85.08 4.66,85.08 4.65,85.09 JP1.5
GPIO17_M2
  Top 0.152: SODIMM_M2_PINOUT.59 32.33,83.33 32.33,82.44 30.57,80.67 12.89,80.67 11.01,82.55 JP1.4
GPIO18_M2
  Top 0.152: SODIMM_M2_PINOUT.63 33.53,83.33 33.53,82.44 31.11,80.01 JP1.3
GPIO19_M2
  Top 0.152: SODIMM_M2_PINOUT.65 34.13,83.33 34.13,82.44 31.2,79.5 6.65,79.5 4.62,77.47 JP1.2
GPIO20_M2
  Top 0.152: SODIMM_M2_PINOUT.69 35.33,83.33 35.33,82.44 31.97,79.07 7.92,79.07 3.79,74.93 JP1.1
GPS_3DFIX  (via drill 0.35)
  Top 0.152: M1.35 36.91,31.54 v38.04,30.42 | v38.1,24.13 v58.42,24.13 | v62.17,24.18 75.62,24.18 82.67,31.23 GPS.P$5
  Bottom 0.152: v38.04,30.42 38.1,30.36 v38.1,24.13 | v58.42,24.13 62.12,24.13 v62.17,24.18
IMU_SCL
  Top 0.152: SCL_IN_IMU.3 67.52,38.1 63.61,38.1 SCL_OUT_IMU.1 62.55,33.98 62.84,33.69 62.84,33.36 IMU.23
IMU_SDA
  Top 0.152: SDA_OUT_IMU.3 56.09,32.49 SDA_IN_IMU1.1 59.52,33.3 IMU.24
INT1_MPL3115  (via drill 0.35)
  Top 0.152: M1.16 24.84,29.29 24.84,24.55 26.54,22.86 v40.64,22.86 | v43.18,22.86 v59.69,22.86 | v63.5,23.47 80.67,23.47 83.26,20.88 83.26,18.2 83.98,17.49 88.06,17.49 89.13,16.41 91.01,16.41 91.54,15.88 MPL3115.6
  Bottom 0.152: v40.64,22.86 v43.18,22.86 | v59.69,22.86 62.89,22.86 v63.5,23.47
INT2_MPL3115
  Top 0.152: M1.15 25.95,30.9 25.66,30.9 24.54,29.77 24.54,24.43 26.41,22.55 33.33,22.55 34.29,21.59 39.78,21.59 40.39,20.98 67.92,20.98 76.2,12.7 90.5,12.7 MPL3115.5
INT_IMU  (via drill 0.35)
  Top 0.152: M1.5 24.26,36.04 v24.13,36.17 | v67.31,29.21 INT_LLC_IMU.3
  Bottom 0.152: v67.31,29.21 55.77,29.21 46.27,38.71 37.85,38.71 28.93,29.79 23.21,29.79 22.25,30.75 22.25,39.62 22.61,39.98 23.11,39.98 24.31,38.78 24.31,37.42 24.13,37.24 v24.13,36.17
INT_SOURCE_IMU
  Top 0.152: IMU.12 66.36,28.34 INT_LLC_IMU.1
MCLR_M1  (via drill 0.35)
  Top 0.152: ICSP.1 90.82,6.03 R11.2 89.96,6.68 87.45,9.2 63.79,9.2 v62.83,10.16 | v60.61,10.16 59.88,10.89 59,10.89 53.38,16.51 v41.25,16.51 | v31.75,21.59 26.52,21.59 v24.07,24.03 | v19.71,34.29 20.65,35.23 R1.2
  Bottom 0.152: v62.83,10.16 v60.61,10.16 | v41.25,16.51 40.23,16.51 39.62,17.12 33.98,17.12 32.72,18.38 32.72,20.51 31.75,21.48 v31.75,21.59 | v24.07,24.03 19.71,28.39 v19.71,34.29
MISO_M2  (via drill 0.35)
  Top 0.152: v20.32,81.28 19.93,81.67 SODIMM_M2_PINOUT.29 | M1.12 25.95,32.68 25.66,32.68 24.96,33.38 v24.13,33.38 | v22.86,78.46 32.88,68.44 33.02,68.3 34.83,66.49 34.83,60.45 39.4,55.88 v40.64,55.88
  Bottom 0.152: v24.13,33.38 40.64,49.89 v40.64,55.88 | v20.32,81.28 22.86,78.74 v22.86,78.46
MOSI_M2  (via drill 0.35)
  Top 0.152: v21.59,81.28 21.13,81.74 SODIMM_M2_PINOUT.33 | M1.11 25.95,33.18 25.66,33.18 24.55,34.29 v24.13,34.29 | v24.13,78.46 36.83,65.76 v36.83,60.96
  Bottom 0.152: v24.13,34.29 39.37,49.53 39.37,58.42 v36.83,60.96 | v21.59,81.28 24.13,78.74 v24.13,78.46
N$2
  Top 0.152: U.FL.P$2 97.32,16.88 95.82,16.88 95.51,17.18 95.51,18.38 95.82,18.68 97.32,18.68 97.74,19.1 | 97.74,19.1 U.FL.P$1 | GPS.P$12 98.17,24.46 97.84,24.46 97.71,24.32 97.71,23.14 97.74,23.11 97.74,19.1
N$3
  Top 0.152: GPS.P$11 98.94,19.85 99.12,19.68 99.12,17.98 U.FL.P$3
N$4
  Top 0.152: EMMC_DISABLE_N.1 11.83,96.86 SODIMM_M2_PINOUT.2
N$5
  Top 0.406: 5V_BUCK_IN.1 6.35,36.3 5V_BUCK_OUT.4 5V_BUCK_OUT.3 5V_BUCK_OUT.2 5V_BUCK_OUT.1
N$6
  Top 0.152: 39.37,37.66 X1.1 39.81,34.89 39.37,34.45 38.05,34.45 37.53,33.93 36.83,33.93 36.33,33.93 36.22,34.04 M1.40
N$7
  Top 0.152: M1.39 37.57,33.54 38.18,34.15 42.88,34.15 X1.3
N$8
  Top 0.152: Y1.1 35.73,38.91 M1.48
N$9
  Top 0.152: M1.47 35.01,37.68 35.3,37.68 35.47,37.86 35.47,38.01 38.86,41.4 38.86,42.98 38.73,43.11 38.17,43.11 37.93,43.35 Y1.3
N$10
  Top 0.152: MPL3115.2 88.53,19.05 C12.1
N$13
  Top 0.152: M1.7 25.95,35.18 25.66,35.18 25.28,35.56 R1.1
N$14
  Top 0.406: R2.2 4.55,25.4 RC_RECEIVER_POWER.1
N$15
  Top 0.152: U1.15 PIC32_USB.8 62.08,6.04 62.08,5.58 61.95,5.45 60.99,5.45 60.85,5.58 60.85,6.04 PIC32_USB.5
N$16
  Top 0.152: 61.57,11.38 61.57,11.04 61.22,10.68 PIC32_USB.6 | 61.57,11.38 U1.14 | PIC32_USB.7 61.72,11.24 61.57,11.38
N$21
  Top 0.152: GPS.P$4 83.17,33.5 81.21,33.5 80.67,34.04 80.67,34.54 81.89,35.75 B1.+$1 78.47,53.34 75.07,56.74 72.25,56.74 68.85,53.34 B1.+$2
N$32
  Top 0.152: IMU.10 63.7,29.09 C2.1
OC1_M1
  Top 0.152: M1.46 35.01,37.18 35.3,37.18 39.28,41.17 39.28,47.08 34.29,52.07 PWM_OUTPUT_MOT_SERVO.1
OC2_M1  (via drill 0.35)
  Top 0.152: M1.49 34.23,50.74 v34.29,50.8 | v34.29,53.34 3.81,53.34 PWM_OUTPUT_MOT_SERVO.2
  Bottom 0.152: v34.29,50.8 v34.29,53.34
OC3_M1  (via drill 0.35)
  Top 0.152: v33.02,54.61 5.08,54.61 PWM_OUTPUT_MOT_SERVO.3 | M1.50 33.73,50.09 v33.02,50.8
  Bottom 0.152: v33.02,50.8 v33.02,54.61
OC4_M1  (via drill 0.35)
  Top 0.152: M1.51 33.23,49.32 v31.75,50.8 | v31.75,55.88 6.35,55.88 PWM_OUTPUT_MOT_SERVO.4
  Bottom 0.152: v31.75,50.8 v31.75,55.88
PGEC2_M1  (via drill 0.35)
  Top 0.152: M1.17 25.45,28.62 25.45,25.41 26.73,24.13 v35.56,24.13 | v35.56,22.25 39.98,22.25 v40.64,21.59 | v76.2,5.08 76.82,4.46 ICSP.5
  Bottom 0.152: v40.64,21.59 59.69,21.59 v76.2,5.08 | v35.56,24.13 v35.56,22.25
PGED2_M1  (via drill 0.35)
  Top 0.152: M1.18 27.23,28.63 26.11,27.52 26.11,25.82 26.25,25.69 26.37,25.69 26.66,25.39 26.67,25.39 27.32,24.74 35.81,24.74 36.17,24.38 36.17,24.13 36.83,23.47 40.89,23.47 42.77,21.59 v60.96,21.59 | v80.01,5.08 80.32,4.77 ICSP.4
  Bottom 0.152: v60.96,21.59 77.47,5.08 v80.01,5.08
RD5_M1  (via drill 0.35)
  Top 0.152: M1.53 32.23,49.05 v30.48,50.8 | v30.48,66.04 3.81,66.04 PWM_OUTPUT_MOT_SERVO.7
  Bottom 0.152: v30.48,50.8 v30.48,66.04
RD6_M1  (via drill 0.35)
  Top 0.152: M1.54 31.73,48.28 v29.21,50.8 | v29.21,67.31 5.08,67.31 PWM_OUTPUT_MOT_SERVO.8
  Bottom 0.152: v29.21,50.8 v29.21,67.31
RF0_M1  (via drill 0.35)
  Top 0.152: M1.58 29.59,38.82 29.59,39.11 26.67,42.03 v26.67,50.8 | v26.67,62.23 PWM_OUTPUT_MOT_SERVO.5
  Bottom 0.152: v26.67,50.8 v26.67,62.23
RF1_M1  (via drill 0.35)
  Top 0.152: M1.59 29.09,38.82 29.09,39.11 25.4,42.8 v25.4,50.8 | v25.4,63.5 3.81,63.5 PWM_OUTPUT_MOT_SERVO.6
  Bottom 0.152: v25.4,50.8 v25.4,63.5
RXD0_M2  (via drill 0.35)
  Top 0.152: SODIMM_M2_PINOUT.60 32.83,93.18 v33.02,93.37 | v52.07,95.25 52.07,97.36 UART_M2.2
  Bottom 0.152: v33.02,93.37 50.19,93.37 v52.07,95.25
SCK_M2  (via drill 0.35)
  Top 0.152: v22.86,81.28 21.73,82.41 SODIMM_M2_PINOUT.35 | M1.13 24.56,32.04 v24.13,32.47 | v25.4,78.46 35.28,68.58 v35.56,68.58 | v41.91,57.15 38.71,60.35 36.58,60.35 36.22,60.71 36.22,61.21 36.29,61.28 36.29,63.5 36.29,63.71 36.29,65.31 v35.56,66.04
  Bottom 0.152: v24.13,32.47 41.91,50.25 v41.91,57.15 | v22.86,81.28 25.4,78.74 v25.4,78.46 | v35.56,68.58 v35.56,66.04
SCL_M1  (via drill 0.35)
  Top 0.152: M1.37 37.2,32.54 38.46,31.28 39.24,31.28 39.78,30.75 39.78,29.51 40.09,29.2 44.77,29.2 R8.1 47.32,29.21 50.8,29.21 | 50.8,29.21 50.8,31.75 60.17,41.12 61.16,41.12 63.12,39.16 SCL_OUT_IMU.3 65.83,39.16 v66.04,39.37 | 50.8,29.21 54.31,29.21 v54.61,29.51 | v57.15,27.94 62.23,22.86 80.01,22.86 81.28,21.59 81.28,20.32 | 81.28,20.32 MPR.3 | SCL_IN_IMU.1 67.42,36.83 v66.04,36.83 | v85.09,20.33 89.32,20.33 89.92,20.93 90.83,20.93 91.44,20.32 91.44,18.14 92.19,18.14 MPL3115.8 | v82.55,20.32 81.28,20.32
  Bottom 0.152: v54.61,29.51 56.18,27.94 v57.15,27.94 | v66.04,36.83 v66.04,39.37 | v85.09,20.33 85.08,20.32 v82.55,20.32
SDA_M1  (via drill 0.35)
  Top 0.152: M1.36 37.27,32.04 38.34,30.98 38.87,30.98 39.47,30.38 39.47,29.38 39.96,28.89 45.1,28.89 R7.1 47.02,28.91 54.61,28.91 | 54.91,28.91 57.59,28.91 SDA_OUT_IMU.1 | 54.61,28.91 54.91,28.91 | MPR.2 78.36,21.59 | 54.61,28.91 61.92,21.59 78.36,21.59 | SDA_IN_IMU1.3 56.09,32.92 55.25,32.08 55.25,29.24 54.91,28.91 | v83.82,21.59 91.03,21.59 92.05,20.57 92.05,19.05 92.18,18.91 93.01,18.91 93.14,18.78 93.14,17.99 92.44,17.29 MPL3115.7 | v80.01,21.59 78.36,21.59
  Bottom 0.152: v83.82,21.59 v80.01,21.59
TRIG_SON0  (via drill 0.35)
  Top 0.152: M1.1 22.23,41.91 v20.32,41.91 | v20.32,31.07 20.32,21.86 22.17,20.02 33.69,20.02 v34.29,19.41 | SON_0.2 36.18,4.43 36.18,5.67 37.8,7.29 37.8,18.39 v37.13,19.05
  Bottom 0.152: v20.32,41.91 v20.32,31.07 | v34.29,19.41 34.65,19.05 v37.13,19.05
TRIG_SON1  (via drill 0.35)
  Top 0.152: M1.2 25.95,37.68 25.66,37.68 22.7,40.64 v21.59,40.64 | v37.13,17.78 37.13,7.49 33.99,4.35 28.17,4.35 26.52,2.7 26.52,2.08 25.86,1.42 24.94,1.42 23.82,2.54 SON_1.2 | v21.59,31.07 v21.59,21.59 | v21.3,20.03 21.73,20.03 22.04,19.71 33.08,19.71 v34.29,18.5
  Bottom 0.152: v37.13,17.78 36.41,18.5 v34.29,18.5 | v21.59,40.64 v21.59,31.07 | v21.59,21.59 21.59,20.32 v21.3,20.03
TRIG_SON2  (via drill 0.35)
  Top 0.152: M1.3 25.19,37.04 v22.86,39.37 | SON_2.2 13.32,4.43 13.32,5.67 13.97,6.32 13.97,6.35 15.24,7.62 34.29,7.62 34.29,17.78 34.17,17.9 34.04,17.9 32.88,19.05 v24.13,19.05 | v22.86,31.07 v22.86,20.62
  Bottom 0.152: v22.86,39.37 v22.86,31.07 | v22.86,20.62 24.13,19.35 v24.13,19.05
TRIG_SON3  (via drill 0.35)
  Top 0.152: M1.4 24.83,36.54 v23.7,37.67 | SON_3.2 45.72,6.35 40.34,11.73 40.34,15.54 v39.37,16.51 | v23.47,30.4 23.47,20.98 24.13,20.32 31.45,20.32 v31.75,20.62
  Bottom 0.152: v23.7,37.67 23.7,36.6 23.52,36.42 23.52,30.45 v23.47,30.4 | v31.75,20.62 32.41,19.96 32.41,18.25 34.15,16.51 v39.37,16.51
TXD0_M2  (via drill 0.35)
  Top 0.152: SODIMM_M2_PINOUT.58 32.23,92.78 v31.75,93.26 | v48.26,95.25 48.26,97.05 UART_M2.1
  Bottom 0.152: v31.75,93.26 33.02,94.53 47.54,94.53 v48.26,95.25
U1RX_M1  (via drill 0.35)
  Top 0.152: M1.34 36.56,31.04 39.01,28.59 40.32,28.59 R9.1 40.97,27.61 v41.91,26.67 | GPS.P$9 77.64,25.23 v77.58,25.29
  Bottom 0.152: v77.58,25.29 62.77,25.29 62.05,26.01 42.57,26.01 v41.91,26.67
U1TX_M1  (via drill 0.35)
  Top 0.152: M1.33 40.01,25.4 R10.1 41.28,25.4 42.01,24.67 43.7,24.67 44.42,25.4 v44.45,25.4 | GPS.P$10 80.84,23.73 80.8,23.77 76.67,23.77 v76.37,24.07
  Bottom 0.152: v76.37,24.07 63.56,24.07 62.23,25.4 v44.45,25.4
U2RX_M1  (via drill 0.35)
  Top 0.152: M1.31 33.87,29.76 33.87,28.77 37.35,25.29 v39.26,25.29 | U1.30 60.07,16.56 60.07,16.9 59.92,17.05 56.76,17.05 53.19,20.62 39.67,20.62 v39.37,20.93
  Bottom 0.152: v39.37,20.93 39.26,21.04 v39.26,25.29
U2TX_M1  (via drill 0.35)
  Top 0.152: M1.32 36.83,27.3 v36.83,26.67 | 58.49,15.24 U1.2 58.37,15.36 58.03,15.36 53.07,20.32 v36.83,20.32
  Bottom 0.152: v36.83,26.67 v36.83,20.32
USB_D+_M2  (via drill 0.35)
  Top 0.152: RASPBERRY_PI_USB.6 RASPBERRY_PI_USB.7 59.69,95.67 v59.69,96.52 | SODIMM_M2_PINOUT.165 64.13,83.73 64.13,84.62 64,84.76 63.83,84.76 v63.5,85.09
  Bottom 0.152: v59.69,96.52 63.5,92.71 v63.5,85.09
USB_D-_M2  (via drill 0.35)
  Top 0.152: 60.17,94.69 60.3,94.83 60.3,95.28 RASPBERRY_PI_USB.5 | RASPBERRY_PI_USB.8 59.08,95.28 59.08,94.83 59.21,94.69 59.69,94.69 60.17,94.69 | 60.17,94.69 63.39,94.69 63.67,94.41 64.34,94.41 64.52,94.59 v66.04,94.59 | v64.77,85.09 64.77,83.69 SODIMM_M2_PINOUT.167
  Bottom 0.152: v66.04,94.59 66.04,86.36 v64.77,85.09
VBUS  (3 unrouted)
VCAP_VCORE_M1
  Top 0.152: C3.1 30.16,41.82 31.09,40.89 31.09,40.39 30.73,40.03 M1.56
VIN  (via drill 0.35)
  Top 0.152: SODIMM_M2_PINOUT.40 23.84,91.73 v25.4,90.17 25.87,90.17 SODIMM_M2_PINOUT.42 | v72.39,90.17 72.39,91.69 SODIMM_M2_PINOUT.192 SODIMM_M2_PINOUT.190 SODIMM_M2_PINOUT.194 | SODIMM_M2_PINOUT.191 SODIMM_M2_PINOUT.193 | SODIMM_M2_PINOUT.191 72.13,84.83 v72.39,85.09 | R8.2 v49.53,30.48 | R7.2 v49.53,27.94 | R11.1 90.5,8.89 v91.44,8.89 | X1.4 44.33,37.78 C22.1 47.31,38.1 v49.53,38.1 | 35.56,44.15 Y1.4 37.47,45.72 v38.1,45.72 | MPR.12 75.31,19.11 C11.1 v74.93,20.32 | SCL_OUT_IMU.2 64.24,36.83 v63.5,36.83 | SDA_IN_IMU1.2 58.21,37.89 v58.42,38.1 | 68.47,25.4 INT_LLC_IMU.2 68.79,25.61 v69.85,26.67 | R10.2 44.12,26.67 | 44.12,26.67 R9.2 v44.45,27.94 | 44.12,26.67 v44.45,26.67 | MPL3115.1 90.17,18.66 v90.17,20.32 | C13.1 87.63,16.51 v88.9,15.24 | MPL3115.4 89.83,15.24 v88.9,15.24 | C7.1 88.58,15.24 v88.9,15.24 | 57.8,16.45 v57.8,16.43 U1.1 | SODIMM_M2_PINOUT.189 SODIMM_M2_PINOUT.191 | SODIMM_M2_PINOUT.39 25.11,83.53 v25.4,83.82 26.84,83.82 SODIMM_M2_PINOUT.41 | M1.57 30.06,38.84 30.06,39.1 29.21,39.95 v29.21,40.64 | GPS.P$1 83.94,39.25 v83.82,39.37 | M1.38 37.77,33.04 37.8,33.02 37.8,32.38 38.59,31.59 39.37,31.59 40.08,30.88 40.08,29.64 40.22,29.5 41.7,29.5 42.68,30.48 C16.2 v44.45,30.48 | M1.26 31.37,29.76 31.37,29.47 33.97,26.87 C15.2 34.1,26.54 v34.1,25.35 | ICSP.2 87.32,8.89 v62.83,8.89 | v60.61,8.89 58.42,8.89 52.07,15.24 v41.25,15.24 | M1.10 25.95,33.68 25.66,33.68 25.09,34.25 25.09,34.88 25.03,34.95 23.81,34.95 23.81,34.84 23.5,34.53 23.1,34.53 22.54,33.97 C17.2 22.54,31.43 22.38,31.27 22.38,30 v22.35,29.97 | M1.19 27.73,27.41 C5.2 26.99,26.35 v27.94,25.4
  Top 0.406: 1V8_OUT.3 93.66,91.64 C9.1 93.66,95.57 v92.71,96.52 | v16.51,8.89 C18.1 18.1,13.46 3V3_OUT.4
  Route15 0.152: v74.93,20.32 76.2,20.32
  Route15 0.406: v25.4,90.17 v25.4,83.82 33.02,76.2 v33.02,60.96 v35.56,60.96 | 35.79,60.96 36.53,61.69 37.13,61.69 37.87,60.96 48.26,60.96 | 48.26,60.96 v72.39,85.09 v72.39,90.17 87.14,90.17 92.71,95.74 v92.71,96.52 | 48.26,60.96 v48.26,46.99 | v48.26,46.99 46.99,45.72 v38.1,45.72 34.29,45.72 v29.21,40.64 | v48.26,46.99 48.26,40.64 49.53,39.37 v49.53,38.1 | v49.53,38.1 v49.53,30.48 v49.53,27.94 48.26,26.67 v44.45,26.67 | v49.53,38.1 v58.42,38.1 59.69,38.1 60.96,36.83 v63.5,36.83 69.85,30.48 v69.85,26.67 | v88.9,15.24 83.09,21.05 82.25,21.05 81.51,20.32 v74.93,20.32 74.93,21.59 v69.85,26.67 | v88.9,15.24 88.9,19.05 v90.17,20.32 90.17,30.15 89.86,30.47 89.86,33.33 v83.82,39.37 | v88.9,15.24 91.44,12.7 v91.44,8.89 | 57.8,16.45 60.9,16.45 69.85,25.4 v69.85,26.67 | v16.51,8.89 31.11,23.5 | 31.11,23.5 34.1,26.48 | 34.1,26.48 35.02,27.4 42.21,27.4 42.95,26.67 v44.45,26.67 | v57.8,16.43 54.69,16.43 v44.45,26.67 | v44.45,30.48 v44.45,27.94 v44.45,26.67 | 31.11,23.5 29.21,25.4 v27.94,25.4 26.93,25.4 v22.35,29.97 | v34.1,25.35 34.1,26.48
  Bottom 0.152: v62.83,8.89 v60.61,8.89 | v41.25,15.24 40.58,15.9 34.33,15.9 31.14,19.09 31.14,22.68 33.86,25.4 v34.1,25.35
  pour Route15: -1.27,102.87 -1.27,-1.27 102.87,-1.27 102.87,102.87

## Text on the board
Top: Barone2 / V1.9 / Dylan Arius Harootunian / Chin Ming Ryan Wong / George Hernandez / Jeremy Germenis / Lenid Shuster / Isaac Szu